# Altium schematic sheet lpf_main.SchDoc: mcHF Pro Transceiver RF board
size A3; Author: Krassi Atanassov; CompanyName: MØNKA; Engineer: For radio amateurs experimentation, non-commercial use only. Thank you!; Revision: 0.8.2; SheetTotal: 14
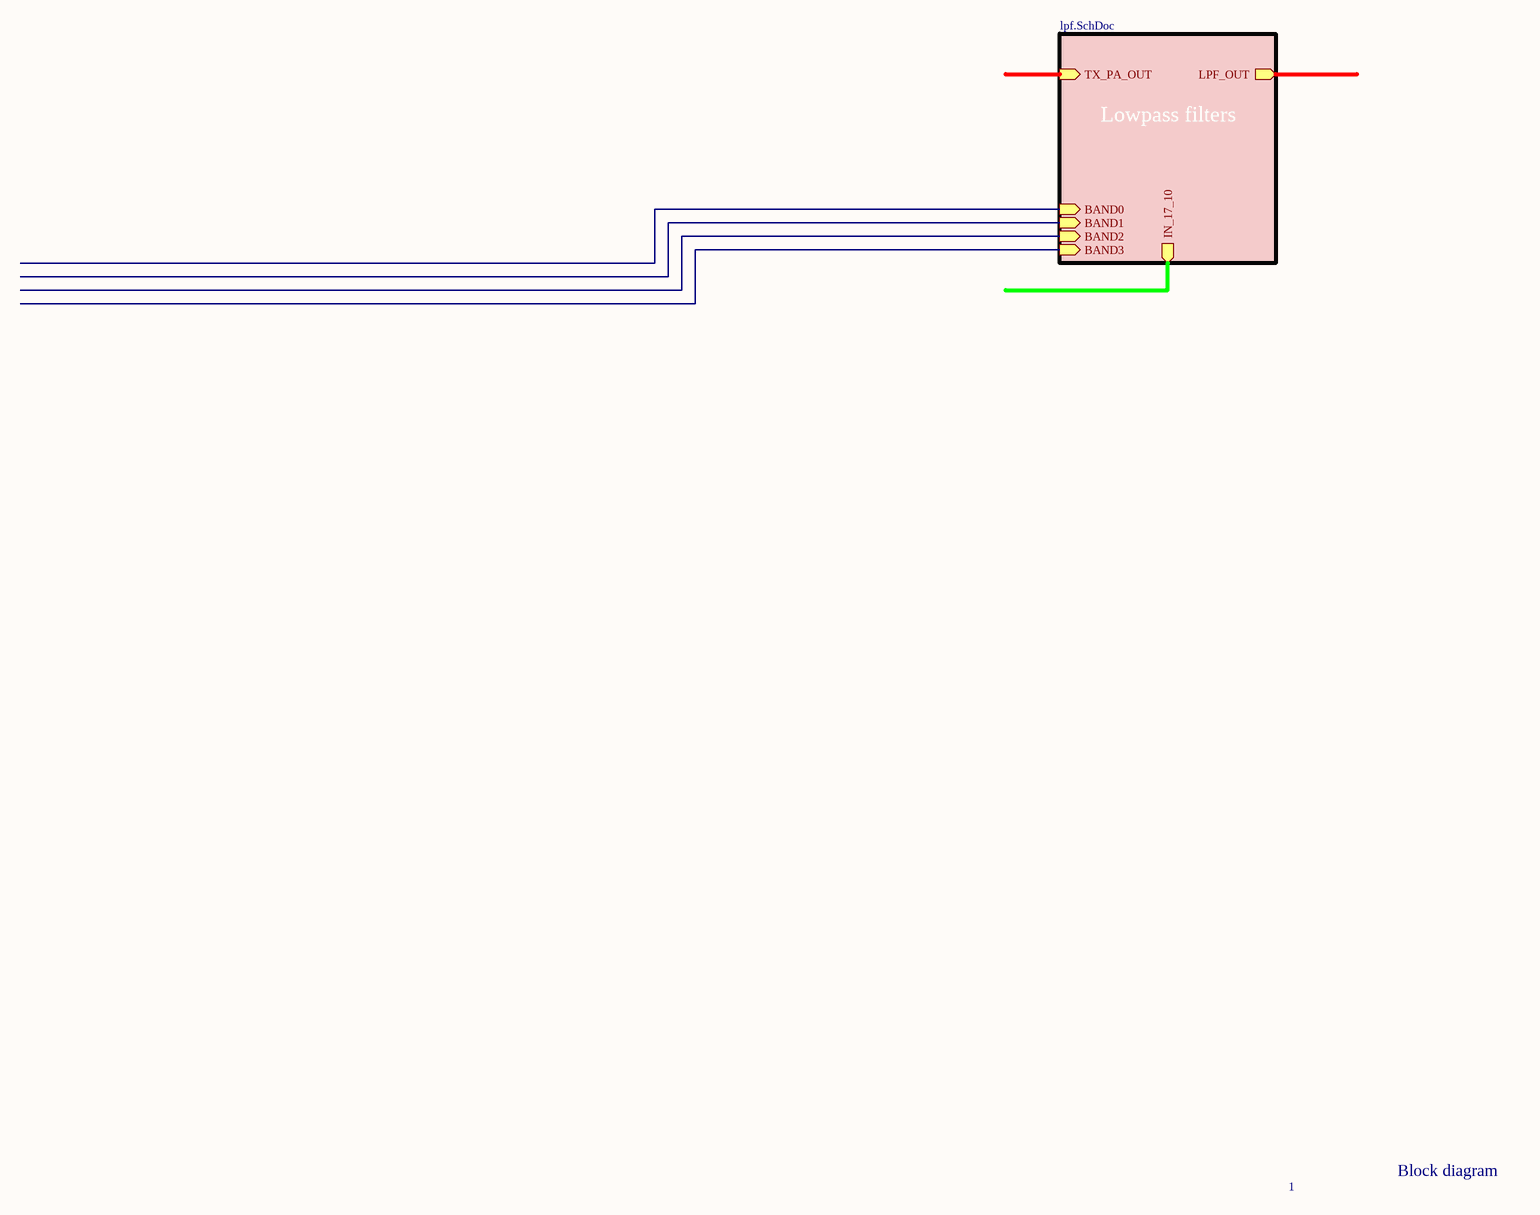
[diagram p0: lpf_main.SchDoc]

## Sub-sheets
Lowpass filters = lpf.SchDoc: TX_PA_OUT (in), LPF_OUT (out), BAND0 (in), BAND1 (in), BAND2 (in), BAND3 (in), IN_17_10 (out)

## Notes on the sheet
- 1
- Block diagram
- Date:
- File:
- Revision:
- Sheet
- of
- Licence: